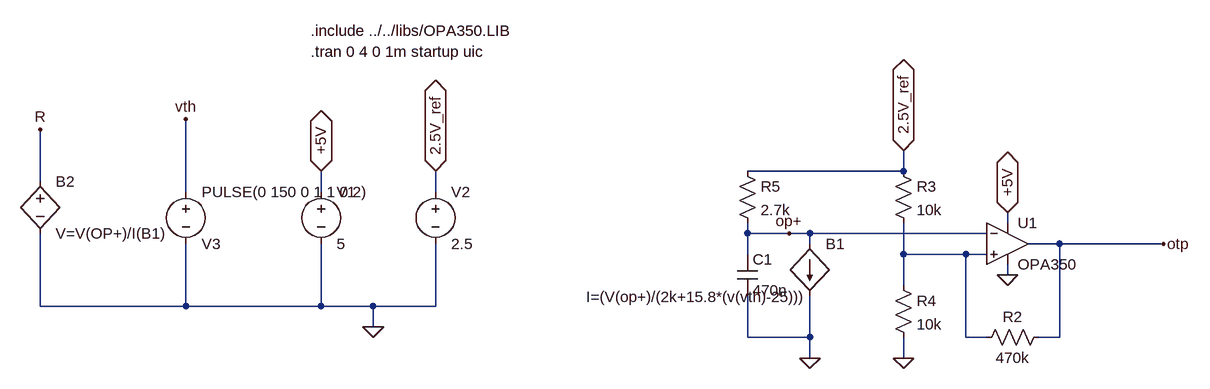
[diagram p0: schematic otp.asc]
otp.asc, the LTspice schematic file:
Version 4
SHEET 1 1108 680
WIRE 416 64 416 32
WIRE 416 64 176 64
WIRE -912 80 -912 0
WIRE -688 96 -688 -16
WIRE -480 96 -480 64
WIRE -304 96 -304 64
WIRE 576 144 576 128
WIRE 176 160 176 144
WIRE 240 160 176 160
WIRE 272 160 240 160
WIRE 544 160 272 160
WIRE 272 176 272 160
WIRE 656 176 608 176
WIRE 816 176 656 176
WIRE 176 192 176 160
WIRE 416 192 416 144
WIRE 512 192 416 192
WIRE 544 192 512 192
WIRE 576 224 576 208
WIRE 416 240 416 192
WIRE -912 272 -912 160
WIRE -688 272 -688 176
WIRE -688 272 -912 272
WIRE -480 272 -480 176
WIRE -480 272 -688 272
WIRE -400 272 -480 272
WIRE -304 272 -304 176
WIRE -304 272 -400 272
WIRE -400 304 -400 272
WIRE 176 320 176 256
WIRE 272 320 272 256
WIRE 272 320 176 320
WIRE 512 320 512 192
WIRE 544 320 512 320
WIRE 656 320 656 176
WIRE 656 320 624 320
WIRE 272 352 272 320
WIRE 416 352 416 320
FLAG 576 128 +5V
IOPIN 576 128 BiDir
FLAG 576 224 0
FLAG 416 32 2.5V_ref
IOPIN 416 32 BiDir
FLAG -480 64 +5V
IOPIN -480 64 BiDir
FLAG -304 64 2.5V_ref
IOPIN -304 64 BiDir
FLAG -400 304 0
FLAG 416 352 0
FLAG 272 352 0
FLAG 816 176 otp
FLAG -688 -16 vth
FLAG 240 160 op+
FLAG -912 0 R
SYMBOL Opamps\\opamp2 576 112 R0
SYMATTR InstName U1
SYMATTR Value OPA350
SYMBOL voltage -480 80 R0
WINDOW 123 0 0 Left 2
WINDOW 39 0 0 Left 2
SYMATTR InstName V1
SYMATTR Value 5
SYMBOL voltage -304 80 R0
WINDOW 123 0 0 Left 2
WINDOW 39 0 0 Left 2
SYMATTR InstName V2
SYMATTR Value 2.5
SYMBOL res 640 304 R90
WINDOW 0 0 56 VBottom 2
WINDOW 3 32 56 VTop 2
SYMATTR InstName R2
SYMATTR Value 470k
SYMBOL res 400 48 R0
SYMATTR InstName R3
SYMATTR Value 10k
SYMBOL res 400 224 R0
SYMATTR InstName R4
SYMATTR Value 10k
SYMBOL res 160 48 R0
SYMATTR InstName R5
SYMATTR Value 2.7k
SYMBOL cap 160 192 R0
SYMATTR InstName C1
SYMATTR Value 470n
SYMBOL voltage -688 80 R0
WINDOW 0 24 96 Left 2
WINDOW 3 24 16 Left 2
WINDOW 123 0 0 Left 2
WINDOW 39 0 0 Left 2
SYMATTR InstName V3
SYMATTR Value PULSE(0 150 0 1 1 0 2)
SYMBOL bi 272 176 R0
WINDOW 3 -344 82 Left 2
SYMATTR Value I=(V(op+)/(2k+15.8*(v(vth)-25)))
SYMATTR InstName B1
SYMBOL bv -912 64 R0
SYMATTR InstName B2
SYMATTR Value V=V(OP+)/I(B1)
TEXT -496 -120 Left 2 !.tran 0 4 0 1m startup uic
TEXT -496 -152 Left 2 !.include ../../libs/OPA350.LIB

The netlist it stands for:
* otp.asc
XU1 N001 op+ +5V 0 otp OPA350  ; pins In+ In- V+ V- OUT
V1 +5V 0 5
V2 2.5V_ref 0 2.5
R2 otp N001 470k
R3 2.5V_ref N001 10k
R4 N001 0 10k
R5 2.5V_ref op+ 2.7k
C1 op+ 0 470n
V3 vth 0 PULSE(0 150 0 1 1 0 2)
B1 op+ 0 I=(V(op+)/(2k+15.8*(v(vth)-25)))
B2 R 0 V=V(OP+)/I(B1)
.tran 0 4 0 1m startup uic
.include ../../libs/OPA350.LIB
.backanno
.end